# EAGLE schematic bd2 (EAGLE 8.2.0)
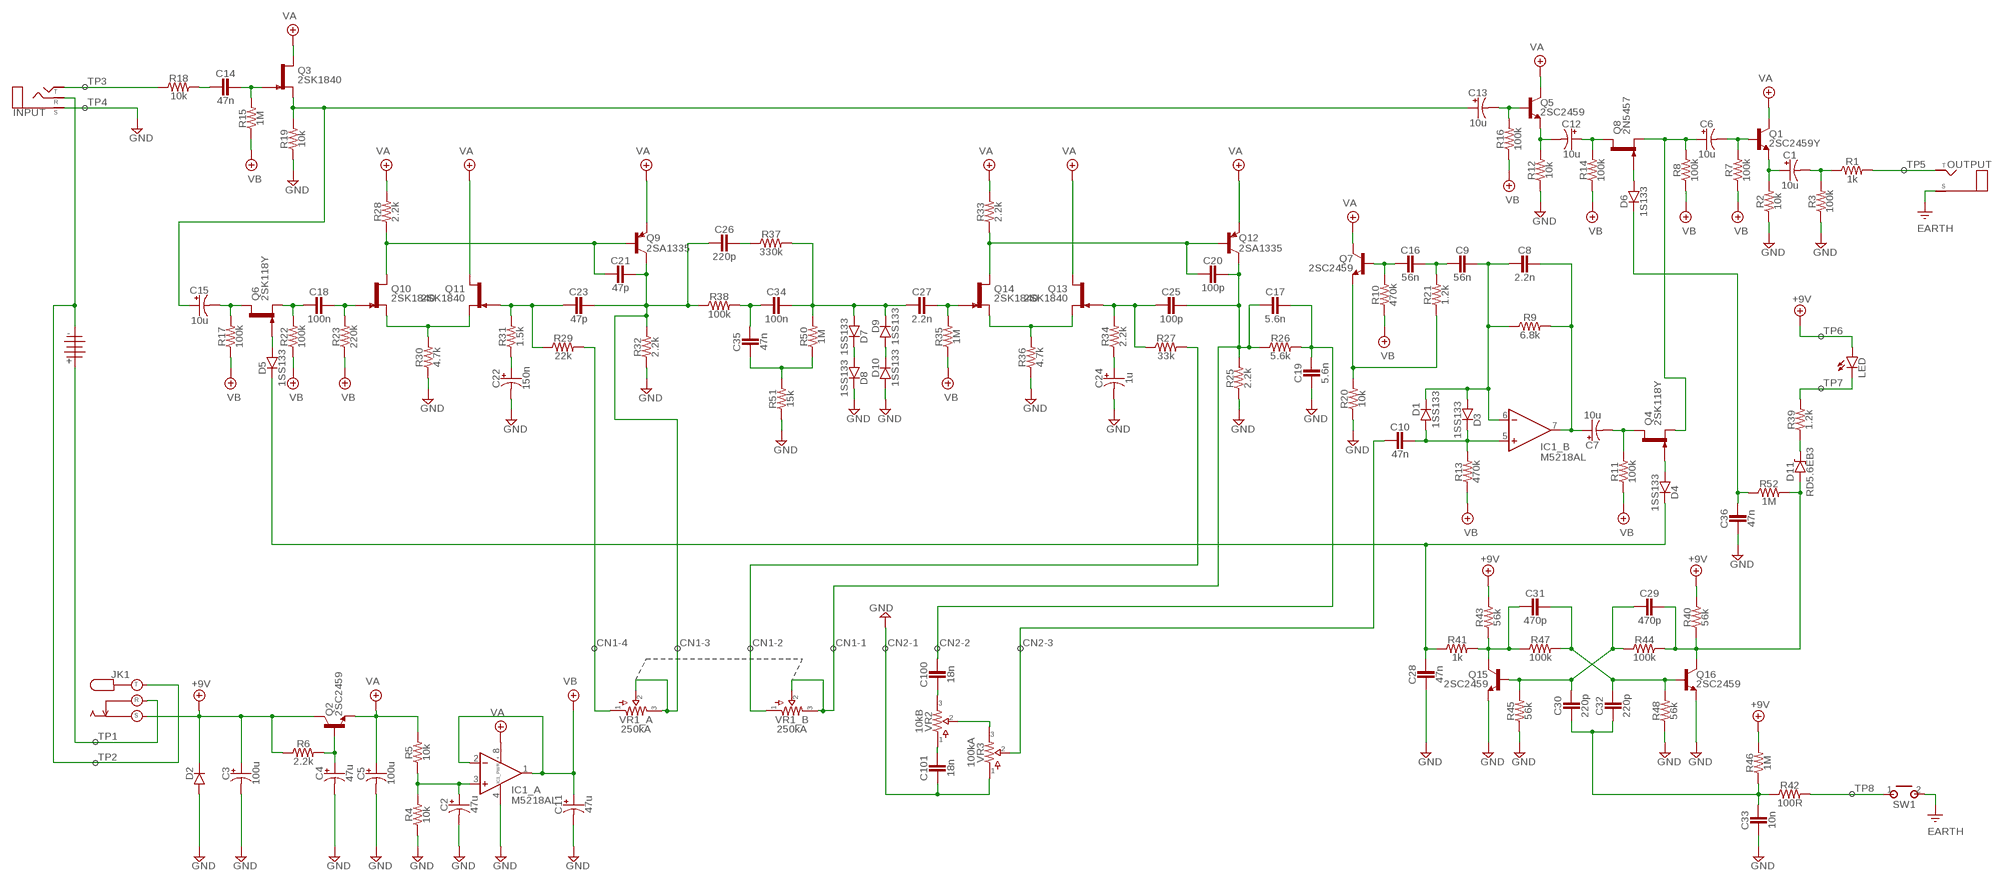
[diagram p0: schematic, sheet 1]

## Parts
BATTERY  BATTERY  [TWO_PADS]
C1  10u  0400  [040_020]
C2  47u  0400  [040_020]
C3  100u  0400  [040_020]
C4  47u  0400  [040_020]
C5  100u  0400  [040_020]
C6  10u  0400  [040_020]
C7  10u  0400  [040_020]
C8  2.2n  CER/FILMBOX.1  [BOX_SMALL]
C9  56n  CER/FILMBOX.1  [BOX_SMALL]
C10  47n  CER/FILMBOX.1  [BOX_SMALL]
C11  47u  0400  [040_020]
C12  10u  0400  [040_020]
C13  10u  0400  [040_020]
C14  47n  CER/FILMBOX.1  [BOX_SMALL]
C15  10u  0400  [040_020]
C16  56n  CER/FILMBOX.1  [BOX_SMALL]
C17  5.6n  CER/FILMBOX.1  [BOX_SMALL]
C18  100n  CER/FILMBOX.1  [BOX_SMALL]
C19  5.6n  CER/FILMBOX.1  [BOX_SMALL]
C20  100p  CER/FILMBOX.1  [BOX_SMALL]
C21  47p  CER/FILMBOX.1  [BOX_SMALL]
C22  150n  0400  [040_020]
C23  47p  CER/FILMBOX.1  [BOX_SMALL]
C24  1u  0400  [040_020]
C25  100p  CER/FILMBOX.1  [BOX_SMALL]
C26  220p  CER/FILMBOX.1  [BOX_SMALL]
C27  2.2n  CER/FILMBOX.1  [BOX_SMALL]
C28  47n  CER/FILMBOX.1  [BOX_SMALL]
C29  470p  CER/FILMBOX.1  [BOX_SMALL]
C30  220p  CER/FILMBOX.1  [BOX_SMALL]
C31  470p  CER/FILMBOX.1  [BOX_SMALL]
C32  220p  CER/FILMBOX.1  [BOX_SMALL]
C33  10n  CER/FILMBOX.1  [BOX_SMALL]
C34  100n  CER/FILMBOX.1  [BOX_SMALL]
C35  47n  CER/FILMBOX.1  [BOX_SMALL]
C36  47n  CER/FILMBOX.1  [BOX_SMALL]
C100  18n  CER/FILMBOX.1  [BOX_SMALL]
C101  18n  CER/FILMBOX.1  [BOX_SMALL]
D1  1SS133  DO41.2  [DO41-2]
D2  DO41.2  [DO41-2]
D3  1SS133  DO41.2  [DO41-2]
D4  1SS133  DO41.2  [DO41-2]
D5  1SS133  DO41.2  [DO41-2]
D6  1S133  DO41.2  [DO41-2]
D7  1SS133  DO41.2  [DO41-2]
D8  1SS133  DO41.2  [DO41-2]
D9  1SS133  DO41.2  [DO41-2]
D10  1SS133  DO41.2  [DO41-2]
D11  RD5.6EB3  ZENER.2  [DO41-2]
IC1  M5218AL  DUALTH  [DIL0]
INPUT  STEREO  [STEREO_PCB]
JK1  JK1  DC_KOBICONN  [DC_KOBICONN]
LED  LED  [3MM_D]
OUTPUT  MONO  [TWO_PADS]
Q1  2SC2459Y  2N3904  [TO92-]
Q2  2SC2459  2N3904  [TO92-]
Q3  2SK1840  2N5457  [TO92-]
Q4  2SK118Y  2N5457  [TO92-]
Q5  2SC2459  2N3904  [TO92-]
Q6  2SK118Y  2N5457  [TO92-]
Q7  2SC2459  2N3904  [TO92-]
Q8  2N5457  [TO92-]
Q9  2SA1335  2N3906-  [TO92-]
Q10  2SK1840  2N5457  [TO92-]
Q11  2SK1840  2N5457  [TO92-]
Q12  2SA1335  2N3906-  [TO92-]
Q13  2SK1840  2N5457  [TO92-]
Q14  2SK1840  2N5457  [TO92-]
Q15  2SC2459  2N3904  [TO92-]
Q16  2SC2459  2N3904  [TO92-]
R1  1k  R_.3B  [R0207/3]
R2  10k  R_.3B  [R0207/3]
R3  100k  R_.3B  [R0207/3]
R4  10k  R_.3B  [R0207/3]
R5  10k  R_.3B  [R0207/3]
R6  2.2k  R_.3B  [R0207/3]
R7  100k  R_.3B  [R0207/3]
R8  100k  R_.3B  [R0207/3]
R9  6.8k  R_.3B  [R0207/3]
R10  470k  R_.3B  [R0207/3]
R11  100k  R_.3B  [R0207/3]
R12  10k  R_.3B  [R0207/3]
R13  470k  R_.3B  [R0207/3]
R14  100k  R_.3B  [R0207/3]
R15  1M  R_.3B  [R0207/3]
R16  100k  R_.3B  [R0207/3]
R17  100k  R_.3B  [R0207/3]
R18  10k  R_.3B  [R0207/3]
R19  10k  R_.3B  [R0207/3]
R20  10k  R_.3B  [R0207/3]
R21  1.2k  R_.3B  [R0207/3]
R22  100k  R_.3B  [R0207/3]
R23  220k  R_.3B  [R0207/3]
R25  2.2k  R_.3B  [R0207/3]
R26  5.6k  R_.3B  [R0207/3]
R27  33k  R_.3B  [R0207/3]
R28  2.2k  R_.3B  [R0207/3]
R29  22k  R_.3B  [R0207/3]
R30  4.7k  R_.3B  [R0207/3]
R31  1.5k  R_.3B  [R0207/3]
R32  2.2k  R_.3B  [R0207/3]
R33  2.2k  R_.3B  [R0207/3]
R34  2.2k  R_.3B  [R0207/3]
R35  1M  R_.3B  [R0207/3]
R36  4.7k  R_.3B  [R0207/3]
R37  330k  R_.3B  [R0207/3]
R38  100k  R_.3B  [R0207/3]
R39  1.2k  R_.3B  [R0207/3]
R40  56k  R_.3B  [R0207/3]
R41  1k  R_.3B  [R0207/3]
R42  100R  R_.3B  [R0207/3]
R43  56k  R_.3B  [R0207/3]
R44  100k  R_.3B  [R0207/3]
R45  56k  R_.3B  [R0207/3]
R46  1M  R_.3B  [R0207/3]
R47  100k  R_.3B  [R0207/3]
R48  56k  R_.3B  [R0207/3]
R50  1M  R_.3B  [R0207/3]
R51  15k  R_.3B  [R0207/3]
R52  1M  R_.3B  [R0207/3]
SW1  MOMENTARY  [SPST]
VR1  250kA  DUALGANG16MM_DUAL  [16MM_DUAL]
VR2  10kB  POTS16MM  [16MM]
VR3  100kA  POTS16MM  [16MM]

## Nets
+9V: C3.+ D2.C JK1.S LED.ANODE(A) Q2.1(C) R6.1 R40.2 R43.2 R46.2
GND: C2.- C3.- C4.- C5.- C11.- C19.2 C22.- C24.- C28.2 C33.2 C36.2 C101.2 D2.A D8.C D10.A IC1.4(_PWR:V-) INPUT.P$1(S) OUTPUT.S(SLEEVE) Q15.3(E) Q16.3(E) R2.1 R3.1 R4.1 R12.1 R19.1 R20.1 R25.1 R30.1 R32.1 R36.1 R45.1 R48.1 R51.1 SW1.2(S) VR3.1 ; supply symbol labelled EARTH
JK1: BATTERY.S INPUT.P$2(R) JK1.T
N$1: INPUT.P$3(T) R18.1
N$2: C14.2 R18.2
N$3: C14.1 Q3.1(G) R15.2
N$4: C13.+ C15.+ Q3.2(S) R19.2
N$5: C15.- Q6.3(D) R17.2
N$6: C18.2 Q6.2(S) R22.2
N$7: C18.1 Q10.1(G) R23.2
N$8: Q10.2(S) Q11.2(S) R30.2
N$9: C22.+ R31.1
N$10: C23.2 Q11.1(G) R29.1 R31.2
N$11: C21.2 Q9.2(B) Q10.3(D) R28.1
N$12: VR2.2 VR3.3
N$13: R29.2 VR1.1
N$14: BATTERY.T JK1.R
N$16: C4.+ Q2.2(B) R6.2
N$17: C27.2 C34.1 D7.A D9.C R37.2 R50.2
N$18: C2.+ IC1.3(_A:+IN) R4.2 R5.1
N$19: C34.2 C35.1 R38.2
N$20: C26.1 R37.1
N$21: C35.2 R50.1 R51.2
N$22: D7.C D8.A
N$23: D9.A D10.C
N$24: C27.1 Q14.1(G) R35.2
N$25: Q13.2(S) Q14.2(S) R36.2
N$26: C25.2 Q13.1(G) R27.1 R34.2
N$27: C24.+ R34.1
N$28: C17.2 C20.1 C25.1 Q12.1(C) R25.2 R26.1 VR1.5 VR1.6
N$29: C20.2 Q12.2(B) Q14.3(D) R33.1
N$30: C17.1 C19.1 C100.1 R26.2
N$31: C21.1 C23.1 C26.2 Q9.1(C) R32.2 R38.1 VR1.2 VR1.3
N$32: R27.2 VR1.4
N$33: C101.1 VR2.1
N$34: C100.2 VR2.3
N$35: Q7.3(E) R20.2 R21.1
N$36: C10.1 D1.A D3.C IC1.5(_B:+IN) R13.2
N$37: C10.2 VR3.2
N$38: C8.2 C9.1 D1.C D3.A IC1.6(_B:-IN) R9.1
N$39: C7.+ C8.1 IC1.7(_B:OUT) R9.2
N$40: C16.2 Q7.2(B) R10.2
N$41: C9.2 C16.1 R21.2
N$42: C7.- Q4.3(D) R11.2
N$43: C13.- Q5.2(B) R16.2
N$44: C12.- Q5.3(E) R12.2
N$45: C12.+ Q8.3(D) R14.2
N$46: C6.+ Q4.2(S) Q8.2(S) R8.2
N$47: C6.- Q1.2(B) R7.2
N$48: C1.+ Q1.3(E) R2.2
N$49: C1.- R1.1 R3.2
N$50: D5.A Q6.1(G)
N$51: D4.A Q4.1(G)
N$52: R42.2 SW1.1(P)
N$53: OUTPUT.T(TIP) R1.2
N$54: C28.1 D4.C D5.C R41.1
N$55: C31.2 Q15.1(C) R41.2 R43.1 R47.1
N$57: C29.2 C30.1 Q15.2(B) R44.1 R45.2
N$58: C31.1 C32.1 Q16.2(B) R47.2 R48.2
N$59: C29.1 D11.A Q16.1(C) R40.1 R44.2 R52.2
N$61: C30.2 C32.2 C33.1 R42.1 R46.1
N$62: C36.1 D6.C R52.1
N$63: D11.C R39.1
N$64: LED.P$1(C) R39.2
N$66: D6.A Q8.1(G)
VA: C5.+ IC1.8(_PWR:V+) Q1.1(C) Q2.3(E) Q3.3(D) Q5.1(C) Q7.1(C) Q9.3(E) Q11.3(D) Q12.3(E) Q13.3(D) R5.2 R28.2 R33.2
VB: C11.+ IC1.1(_A:OUT) IC1.2(_A:-IN) R7.1 R8.1 R10.1 R11.1 R13.1 R14.1 R15.1 R16.1 R17.1 R22.1 R23.1 R35.1

## Notes on the sheet
- TP3
- TP4
- TP5
- TP6
- TP7
- CN1-4 | CN1-3 | CN1-2 | CN1-1 | CN2-1 | CN2-2 | CN2-3
- TP1
- TP2
- TP8

## Library data of the parts
BATTERY = pedals-jacks:BATTERY
C1-C7 C11-C13 C15 C22 C24 = pedals-capacitors-elec:040
C8-C10 C14 C16-C21 C23 C25-C36 C100 C101 = pedals-capacitors-film:CER/FILM: 47 - 120pF Xicon Ceramic Disc 2.5mm lead spacing
D1-D10 = pedals-diodes:DO41: DO-41 Package Diodes: 1N4001 - 1N40019 Zener Diodes: 1N4728 - 1N4764
D11 = pedals-diodes:ZENER
IC1 = pedals-integrated circuits:DUAL: OP AMP
INPUT = pedals-jacks:STEREO
JK1 = pedals-jacks:DC_KOBICONN
LED = pedals-diodes:LED
OUTPUT = pedals-jacks:MONO: Mono 1/4" Phone Jack
Q1 Q2 Q5 Q7 Q15 Q16 = pedals-transistors:2N3904: NPN Transistor
Q3 Q4 Q6 Q8 Q10 Q11 Q13 Q14 = pedals-transistors:2N5457: N-CHANNEL JFET
Q9 Q12 = pedals-transistors:2N3906: PNP Transistor
R1-R23 R25-R48 R50-R52 = pedals-resistors:R_
SW1 = pedals-switches:MOMENTARY
VR1 = pedals-potentiometers:DUALGANG
VR2 VR3 = pedals-potentiometers:POTS